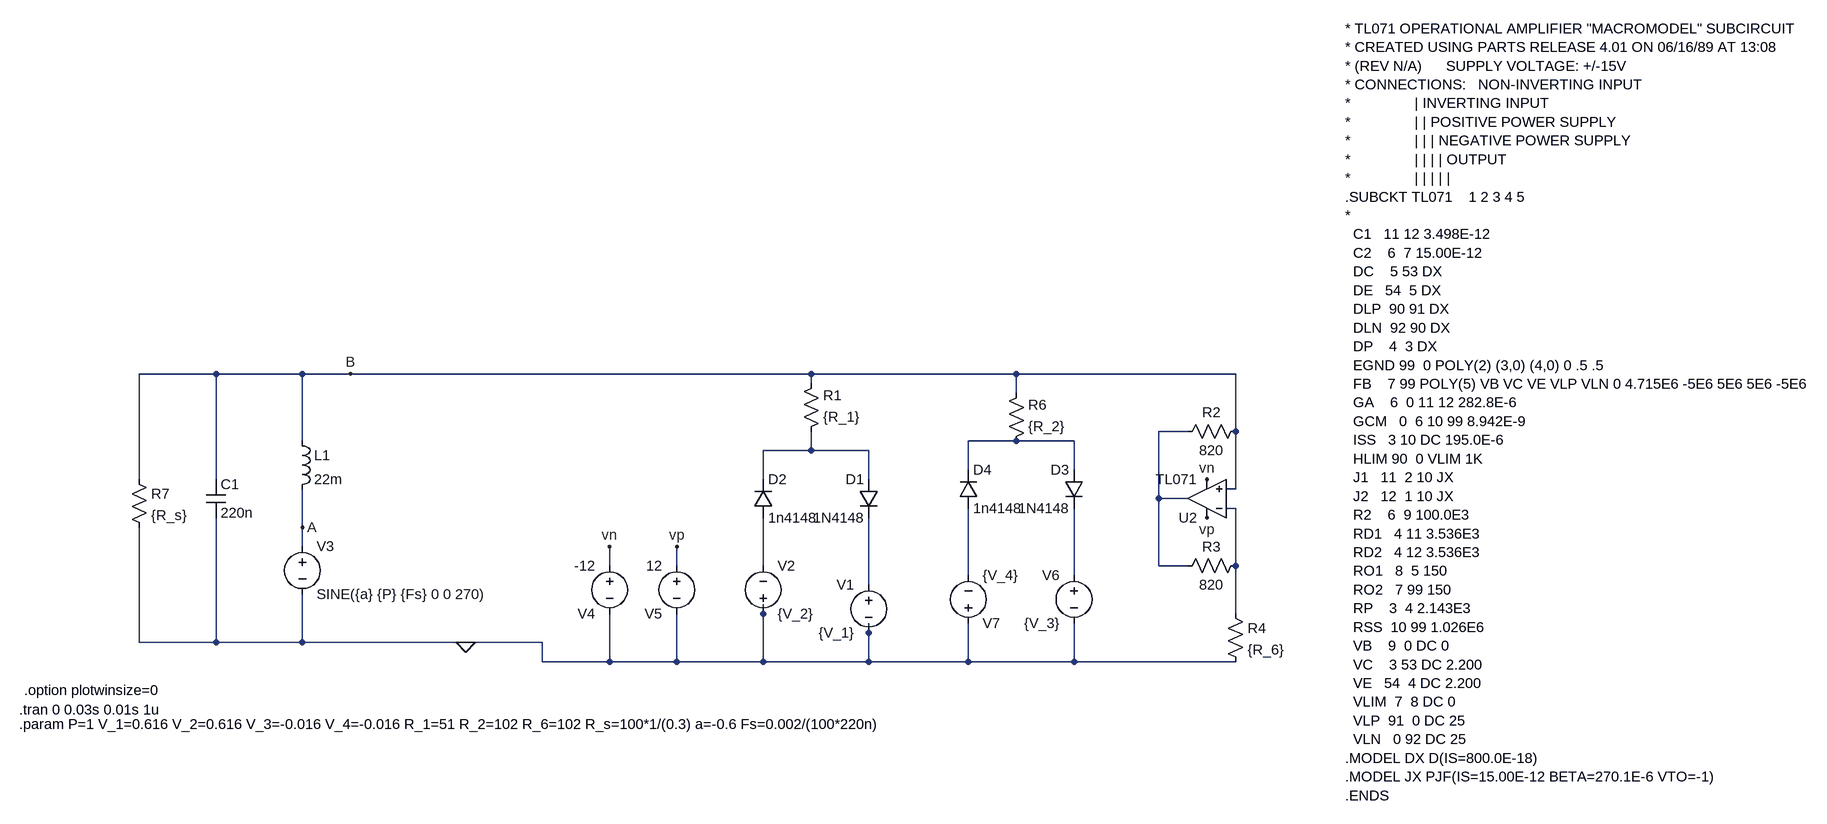
[diagram p0: schematic circuit_conf_model_definitiu_reduït_tl071_teoric_mmo.asc]
circuit_conf_model_definitiu_reduït_tl071_teoric_mmo.asc, the LTspice schematic file:
Version 4
SHEET 1 2520 760
WIRE -944 -128 -1072 -128
WIRE -800 -128 -944 -128
WIRE -720 -128 -800 -128
WIRE 48 -128 -720 -128
WIRE 400 -128 48 -128
WIRE 912 -128 400 -128
WIRE 48 -112 48 -128
WIRE 400 -96 400 -128
WIRE 832 -32 784 -32
WIRE 912 -32 912 -128
WIRE -800 -16 -800 -128
WIRE 400 -16 320 -16
WIRE 496 -16 400 -16
WIRE 48 0 48 -32
WIRE 48 0 -32 0
WIRE 144 0 48 0
WIRE 320 32 320 -16
WIRE 496 32 496 -16
WIRE -1072 48 -1072 -128
WIRE -944 48 -944 -128
WIRE -32 48 -32 0
WIRE 144 48 144 0
WIRE 912 64 912 -32
WIRE 912 64 896 64
WIRE 784 80 784 -32
WIRE 832 80 784 80
WIRE 912 96 896 96
WIRE -800 128 -800 64
WIRE -800 160 -800 128
WIRE -288 192 -288 160
WIRE -176 192 -176 160
WIRE -32 192 -32 112
WIRE 784 192 784 80
WIRE 832 192 784 192
WIRE 912 192 912 96
WIRE 320 208 320 96
WIRE 496 208 496 96
WIRE 144 224 144 112
WIRE -32 272 -32 256
WIRE 912 272 912 192
WIRE 144 304 144 288
WIRE -1072 320 -1072 128
WIRE -944 320 -944 112
WIRE -944 320 -1072 320
WIRE -800 320 -800 240
WIRE -800 320 -944 320
WIRE -528 320 -800 320
WIRE -400 320 -528 320
WIRE -400 352 -400 320
WIRE -288 352 -288 272
WIRE -288 352 -400 352
WIRE -176 352 -176 272
WIRE -176 352 -288 352
WIRE -32 352 -32 272
WIRE -32 352 -176 352
WIRE 144 352 144 304
WIRE 144 352 -32 352
WIRE 320 352 320 288
WIRE 320 352 144 352
WIRE 496 352 496 288
WIRE 496 352 320 352
WIRE 912 352 496 352
FLAG -176 160 vp
FLAG 864 112 vp
FLAG -288 160 vn
FLAG 864 48 vn
FLAG -528 320 0
FLAG -800 128 A
FLAG -720 -128 B
SYMBOL voltage 144 208 M0
SYMATTR InstName V1
SYMATTR Value {V_1}
SYMBOL voltage -32 288 M180
WINDOW 0 24 96 Left 2
WINDOW 3 24 16 Left 2
SYMATTR InstName V2
SYMATTR Value {V_2}
SYMBOL diode 160 48 M0
SYMATTR InstName D1
SYMATTR Value 1N4148
SYMBOL diode -48 112 M180
WINDOW 0 24 64 Left 2
WINDOW 3 24 0 Left 2
SYMATTR InstName D2
SYMATTR Value 1n4148
SYMBOL res 32 -16 M180
WINDOW 0 36 76 Left 2
WINDOW 3 36 40 Left 2
SYMATTR InstName R1
SYMATTR Value {R_1}
SYMBOL res 928 -48 R90
WINDOW 0 0 56 VBottom 2
WINDOW 3 32 56 VTop 2
SYMATTR InstName R2
SYMATTR Value 820
SYMBOL res 928 176 R90
WINDOW 0 0 56 VBottom 2
WINDOW 3 32 56 VTop 2
SYMATTR InstName R3
SYMATTR Value 820
SYMBOL res 896 256 R0
SYMATTR InstName R4
SYMATTR Value {R_6}
SYMBOL voltage -288 176 M0
WINDOW 0 24 96 Left 2
WINDOW 3 24 16 Left 2
WINDOW 123 0 0 Left 0
WINDOW 39 0 0 Left 0
SYMATTR InstName V4
SYMATTR Value -12
SYMBOL voltage -176 176 M0
WINDOW 0 24 96 Left 2
WINDOW 3 24 16 Left 2
WINDOW 123 0 0 Left 0
WINDOW 39 0 0 Left 0
SYMATTR InstName V5
SYMATTR Value 12
SYMBOL voltage 496 192 M0
WINDOW 123 0 0 Left 0
WINDOW 39 0 0 Left 0
SYMATTR InstName V6
SYMATTR Value {V_3}
SYMBOL voltage 320 304 M180
WINDOW 123 0 0 Left 0
WINDOW 39 0 0 Left 0
SYMATTR InstName V7
SYMATTR Value {V_4}
SYMBOL diode 512 32 M0
SYMATTR InstName D3
SYMATTR Value 1N4148
SYMBOL diode 304 96 M180
WINDOW 0 24 64 Left 2
WINDOW 3 24 0 Left 2
SYMATTR InstName D4
SYMATTR Value 1n4148
SYMBOL res 384 0 M180
WINDOW 0 36 76 Left 2
WINDOW 3 36 40 Left 2
SYMATTR InstName R6
SYMATTR Value {R_2}
SYMBOL cap -960 48 R0
SYMATTR InstName C1
SYMATTR Value 220n
SYMBOL ind -816 -32 R0
SYMATTR InstName L1
SYMATTR Value 22m
SYMATTR SpiceLine Rser=50
SYMBOL voltage -800 144 R0
WINDOW 123 0 0 Left 0
WINDOW 39 0 0 Left 0
SYMATTR InstName V3
SYMATTR Value SINE({a} {P} {Fs} 0 0 270)
SYMBOL res -1088 32 R0
SYMATTR InstName R7
SYMATTR Value {R_s}
SYMBOL OpAmps\\opamp2 864 144 R180
SYMATTR InstName U2
SYMATTR Value TL071
TEXT -1272 432 Left 2 !.tran 0 0.03s 0.01s 1u
TEXT -1272 456 Left 2 !.param P=1 V_1=0.616 V_2=0.616 V_3=-0.016 V_4=-0.016 R_1=51 R_2=102 R_6=102 R_s=100*1/(0.3) a=-0.6 Fs=0.002/(100*220n)
TEXT 1728 -704 Left 2 !* TL071 OPERATIONAL AMPLIFIER "MACROMODEL" SUBCIRCUIT\n* CREATED USING PARTS RELEASE 4.01 ON 06/16/89 AT 13:08\n* (REV N/A)      SUPPLY VOLTAGE: +/-15V\n* CONNECTIONS:   NON-INVERTING INPUT\n*                | INVERTING INPUT\n*                | | POSITIVE POWER SUPPLY\n*                | | | NEGATIVE POWER SUPPLY\n*                | | | | OUTPUT\n*                | | | | |\n.SUBCKT TL071    1 2 3 4 5\n*\n  C1   11 12 3.498E-12\n  C2    6  7 15.00E-12\n  DC    5 53 DX\n  DE   54  5 DX\n  DLP  90 91 DX\n  DLN  92 90 DX\n  DP    4  3 DX\n  EGND 99  0 POLY(2) (3,0) (4,0) 0 .5 .5\n  FB    7 99 POLY(5) VB VC VE VLP VLN 0 4.715E6 -5E6 5E6 5E6 -5E6\n  GA    6  0 11 12 282.8E-6\n  GCM   0  6 10 99 8.942E-9\n  ISS   3 10 DC 195.0E-6\n  HLIM 90  0 VLIM 1K\n  J1   11  2 10 JX\n  J2   12  1 10 JX\n  R2    6  9 100.0E3\n  RD1   4 11 3.536E3\n  RD2   4 12 3.536E3\n  RO1   8  5 150\n  RO2   7 99 150\n  RP    3  4 2.143E3\n  RSS  10 99 1.026E6\n  VB    9  0 DC 0\n  VC    3 53 DC 2.200\n  VE   54  4 DC 2.200\n  VLIM  7  8 DC 0\n  VLP  91  0 DC 25\n  VLN   0 92 DC 25\n.MODEL DX D(IS=800.0E-18)\n.MODEL JX PJF(IS=15.00E-12 BETA=270.1E-6 VTO=-1)\n.ENDS
TEXT -1264 400 Left 2 !.option plotwinsize=0

The netlist it stands for:
* circuit_conf_model_definitiu_reduït_tl071_teoric_mmo.asc
V1 N008 0 {V_1}
V2 0 N005 {V_2}
D1 N003 N008 1N4148
D2 N005 N003 1n4148
R1 N003 B {R_1}
R2 B N001 820
R3 N004 N001 820
R4 N004 0 {R_6}
V4 vn 0 -12
V5 vp 0 12
V6 N007 0 {V_3}
V7 0 N006 {V_4}
D3 N002 N007 1N4148
D4 N006 N002 1n4148
R6 N002 B {R_2}
C1 B 0 220n
L1 B A 22m Rser=50
V3 A 0 SINE({a} {P} {Fs} 0 0 270)
R7 B 0 {R_s}
XU2 B N004 vp vn N001 TL071  ; pins In+ In- V+ V- OUT
.model D D
.lib standard.dio
.tran 0 0.03s 0.01s 1u
.param P=1 V_1=0.616 V_2=0.616 V_3=-0.016 V_4=-0.016 R_1=51 R_2=102 R_6=102 R_s=100*1/(0.3) a=-0.6 Fs=0.002/(100*220n)
* TL071 OPERATIONAL AMPLIFIER "MACROMODEL" SUBCIRCUIT
* CREATED USING PARTS RELEASE 4.01 ON 06/16/89 AT 13:08
* (REV N/A)      SUPPLY VOLTAGE: +/-15V
* CONNECTIONS:   NON-INVERTING INPUT
*                | INVERTING INPUT
*                | | POSITIVE POWER SUPPLY
*                | | | NEGATIVE POWER SUPPLY
*                | | | | OUTPUT
*                | | | | |
.SUBCKT TL071    1 2 3 4 5
*
  C1   11 12 3.498E-12
  C2    6  7 15.00E-12
  DC    5 53 DX
  DE   54  5 DX
  DLP  90 91 DX
  DLN  92 90 DX
  DP    4  3 DX
  EGND 99  0 POLY(2) (3,0) (4,0) 0 .5 .5
  FB    7 99 POLY(5) VB VC VE VLP VLN 0 4.715E6 -5E6 5E6 5E6 -5E6
  GA    6  0 11 12 282.8E-6
  GCM   0  6 10 99 8.942E-9
  ISS   3 10 DC 195.0E-6
  HLIM 90  0 VLIM 1K
  J1   11  2 10 JX
  J2   12  1 10 JX
  R2    6  9 100.0E3
  RD1   4 11 3.536E3
  RD2   4 12 3.536E3
  RO1   8  5 150
  RO2   7 99 150
  RP    3  4 2.143E3
  RSS  10 99 1.026E6
  VB    9  0 DC 0
  VC    3 53 DC 2.200
  VE   54  4 DC 2.200
  VLIM  7  8 DC 0
  VLP  91  0 DC 25
  VLN   0 92 DC 25
.MODEL DX D(IS=800.0E-18)
.MODEL JX PJF(IS=15.00E-12 BETA=270.1E-6 VTO=-1)
.ENDS
.option plotwinsize=0
.backanno
.end